# Altium schematic sheet GateDriver.SchDoc
size A3; SheetNumber: 1; SheetTotal: 1
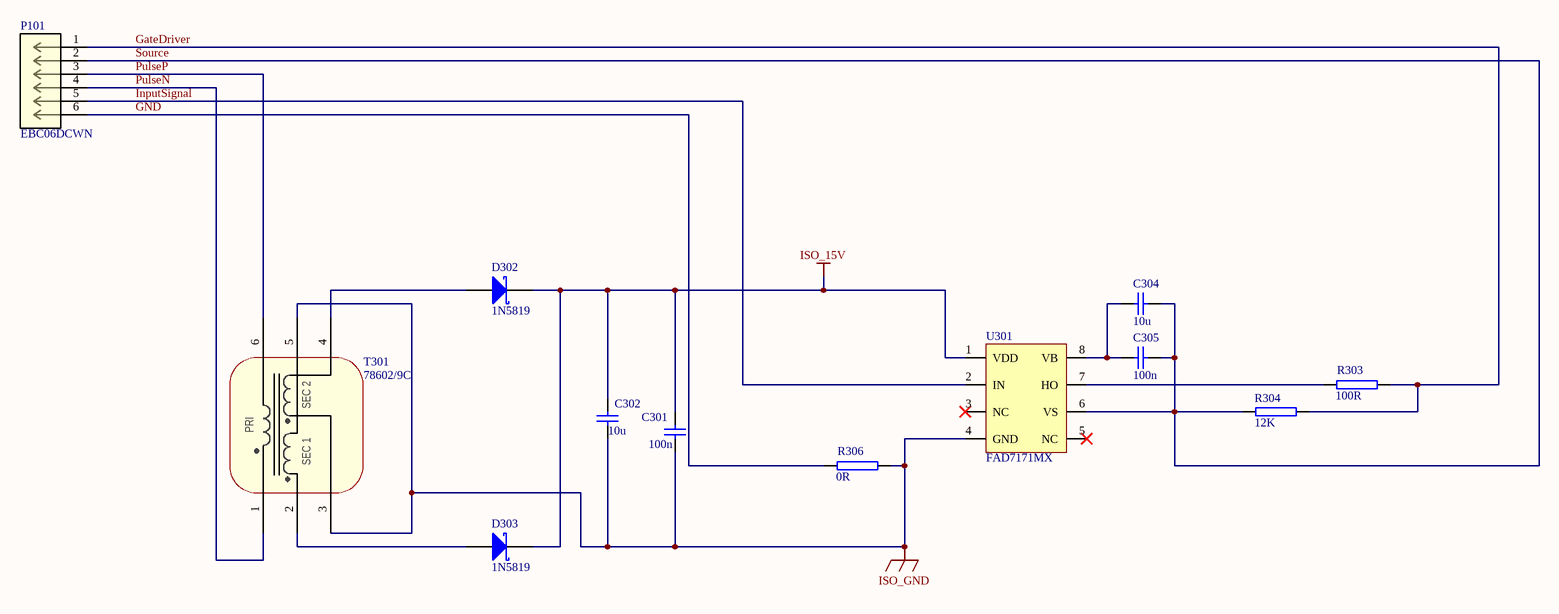
[diagram p0: GateDriver.SchDoc]

## Parts
C301  100n  [CAP_1206]
C302  10u  [CAP_1206]
C304  10u  [CAP_1206]
C305  100n  [CAP_1206]
D302  1N5819  [DIODE0.4_AUT]
D303  1N5819  [DIODE0.4_AUT]
P101  EBC06DCWN  [6 Pose edge Connector]
R303  100R  [RES_1206]
R304  12K  [RES_1206]
R306  0R  [RES_1206]
T301  78602/9C  [DIP6W_AUT]
U301  FAD7171MX  [SOIC8-M]

## Nets
ISO_15V: C301.2 C302.2 D302.K D303.K U301.1(VDD)
ISO_GND: C301.1 C302.1 R306.1 T301.3(Sec1_2) T301.5(Sec1_2) U301.4(GND)
GateDriver: P101.1 R303.2 R304.1
GND: P101.6 R306.2
InputSignal: P101.5 U301.2(IN)
PulseN: P101.4 T301.1(Pri_1)
PulseP: P101.3 T301.6(Pri2)
Source: C304.1 C305.1 P101.2 R304.2 U301.6(VS)
NetC304_2: C304.2 C305.2 U301.8(VB)
NetD302_A: D302.A T301.4(Sec2_2)
NetD303_A: D303.A T301.2(Sec1_1)
NetR303_1: R303.1 U301.7(HO)

Not connected (* = marked no-connect by the designer): U301 3(NC)* 5(NC)*

## Notes on the sheet
- (in symbol 78602/9C) SEC 2; PRI; SEC 1

## Library data of the parts
C301 C302 C304 C305 = CAPN 1206: Non Polarized Capacitor, SMD, 1206
D302 D303 = 1N5819: Schottky Diode, 1A,40v; Supplier 1: Farnell; Supplier Part Number 1: 1017589
P101 = EdgeConnector: 6 Position male Connector Non Specified - Dual Edge Gold 0.100" (2.54mm) Blue
R303 R304 R306 = Resistor 1206: Resistor, SMD, 1206
T301 = 78602/9C: Pulse transformer 1:1:1
U301 = FAD7171MX: High-Side Gate Driver IC Non-Inverting PG-DSO-8 / 8-SOIC (0.154", 3.90mm Width) / https://www.digikey.co.nz/en/products/detail/onsemi/FAD7171MX/24627314